# Altium schematic sheet primary_dcdc_converter.SchDoc: foxBMS BMS-Slave 12-Cell
size A3; DocumentNumber: 11; SheetNumber: 11; SheetTotal: 21; AUTHOR: Fraunhofer IISB foxBMS Team; SheetDescription: DC/DC Converter
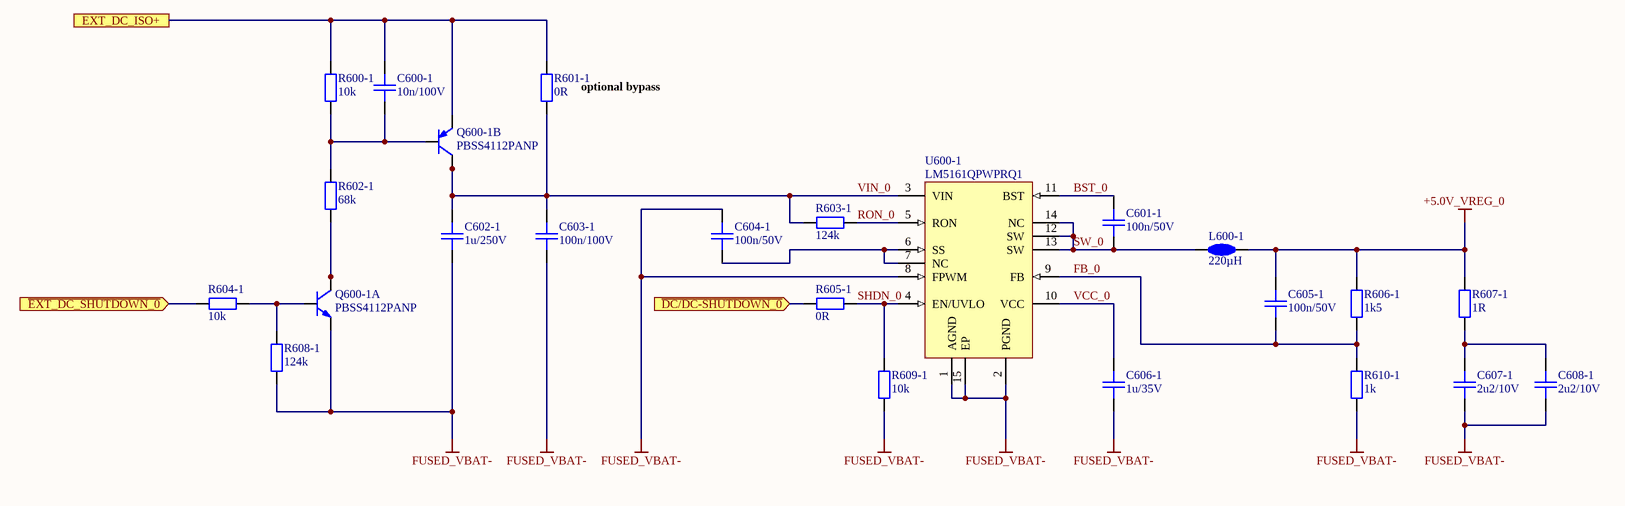
[diagram p0: primary_dcdc_converter.SchDoc]

## Parts
C600-1  10n/100V  [CAPC1608X08N]
C601-1  100n/50V  [CAPC1608X08N]
C602-1  1u/250V  [CAPC4532X16N]
C603-1  100n/100V  [CAPC2012X14N]
C604-1  100n/50V  [CAPC1608X08N]
C605-1  100n/50V  [CAPC1608X08N]
C606-1  1u/35V  [CAPC1608X08N]
C607-1  2u2/10V  [CAPC2012X14N]
C608-1  2u2/10V  [CAPC2012X14N]
L600-1  220µH  [TYS6045221M-10]
Q600-1  PBSS4112PANP  [PBSS4112PANP]  (parts A,B of 2)
R600-1  10k  [RESC1608X05N]
R601-1  0R  [RESC1608X05N]
R602-1  68k  [RESC1608X05N]
R603-1  124k  [RESC1608X05N]
R604-1  10k  [RESC1608X05N]
R605-1  0R  [RESC1608X05N]
R606-1  1k5  [RESC1608X05N]
R607-1  1R  [RESC2012X05N]
R608-1  124k  [RESC1608X05N]
R609-1  10k  [RESC1608X05N]
R610-1  1k  [RESC1608X05N]
U600-1  LM5161QPWPRQ1  [PWP0014A]

## Ports
EXT_DC_ISO+, ~{DC/DC-SHUTDOWN_0} (in), ~{EXT_DC_SHUTDOWN_0} (in)

## Nets
+5.0V_VREG_0: C605-1.2 L600-1.2 R606-1.1 R607-1.1
FUSED_VBAT-: C602-1.1 C603-1.1 C604-1.2 C606-1.2 C607-1.1 C608-1.1 Q600-1.1(E) R608-1.1 R609-1.2 R610-1.2 U600-1.1(AGND) U600-1.2(PGND) U600-1.8(FPWM) U600-1.15(EP)
~{DC/DC-SHUTDOWN_0}: R605-1.2 ; port ~{DC/DC-SHUTDOWN_0}
~{EXT_DC_SHUTDOWN_0}: R604-1.1 ; port ~{EXT_DC_SHUTDOWN_0}
BST_0: C601-1.2 U600-1.11(BST)
EXT_DC_ISO+: C600-1.1 Q600-1.4(E) R600-1.2 R601-1.2 ; port EXT_DC_ISO+
FB_0: C605-1.1 R606-1.2 R610-1.1 U600-1.9(FB)
RON_0: R603-1.1 U600-1.5(RON)
SHDN_0: R605-1.1 R609-1.1 U600-1.4(EN/UVLO)
SW_0: C601-1.1 L600-1.1 U600-1.12(SW) U600-1.13(SW) U600-1.14(NC)
VCC_0: C606-1.1 U600-1.10(VCC)
VIN_0: C602-1.2 C603-1.2 Q600-1.3(C) Q600-1.8(C) R601-1.1 R603-1.2 U600-1.3(VIN)
NetC600-1_2: C600-1.2 Q600-1.5(B) R600-1.1 R602-1.2
NetC604-1_1: C604-1.1 U600-1.6(SS) U600-1.7(NC)
NetC607-1_2: C607-1.2 C608-1.2 R607-1.2
NetQ600-1_2: Q600-1.2(B) R604-1.2 R608-1.2
NetQ600-1_6: Q600-1.6(C) Q600-1.7(C) R602-1.1

## Notes on the sheet
- (near R601-1) optional bypass
- Fraunhofer IISB
- Schottkystr. 10
- developed by:
- 91058 Erlangen
- Germany
- Author
- Project
- License
- Description
- File
- Version
- Release Date
- Sheet
- www.foxbms.org
- www.iisb.fraunhofer.de
- foxBMS Team
- /

## Library data of the parts
C600-1 = gen_C_ceramic_10n_100V_X7R_0603: MLCC; Capacitance: 10n; Rated Voltage: 100V; Dielectric: X7R; Case EIA: 0603; Case Metric: 1608; Automotive Qualified: True; PnP Package: C_0603_10; PnP Value: 10n/100V/X7R; Part Number: gen_C_ceramic_10n_100V_X7R_0603; Supplier 1: Farnell; Supplier Part Number 1: 1301715; Supplier 2: Farnell; Supplier Part Number 2: 2821192; Supplier 3: Farnell; Supplier Part Number 3: 2210878
C601-1 C604-1 C605-1 = gen_C_ceramic_100n_50V_X7R_0603: MLCC; Capacitance: 100n; Rated Voltage: 50V; Dielectric: X7R; Case EIA: 0603; Case Metric: 1608; PnP Package: C_0603_10; PnP Value: 100n/50V/X7R; PnP equipped: x; Automotive Qualified: True; Part Number: gen_C_ceramic_100n_50V_X7R_0603; Supplier 1: Farnell; Supplier Part Number 1: 2525267; Supplier 2: Digikey; Supplier Part Number 2: 490-6049-1-ND; Supplier 3: Farnell; Supplier Part Number 3: 2070398
C602-1 = gen_C_ceramic_1u_250V_X7R_1812: MLCC; Capacitance: 1u; Rated Voltage: 250V; Dielectric: X7T; Case EIA: 1812; Case Metric: 4532; Automotive Qualified: True; Part Number: gen_C_ceramic_1u_250V_X7R_1812; Supplier 1: Farnell; Supplier Part Number 1: 2435499
C603-1 = gen_C_ceramic_100n_100V_X7R_0805: MLCC; Capacitance: 100n; Rated Voltage: 100V; Dielectric: X7R; Case EIA: 0805; Case Metric: 2012; Automotive Qualified: False; Part Number: gen_C_ceramic_100n_100V_X7R_0805; Supplier 1: Farnell; Supplier Part Number 1: 2320821
C606-1 = gen_C_ceramic_1u_35V_X7R_0603: MLCC; Capacitance: 1u; Rated Voltage: 35V; Dielectric: X7R; Case EIA: 0603; Case Metric: 1608; PnP Package: C_0603_10; PnP Value: 1uF/35V/X7R; PnP equipped: x; Automotive Qualified: False; Part Number: gen_C_ceramic_1u_35V_X7R_0603; Supplier 1: Farnell; Supplier Part Number 1: 1907508
C607-1 C608-1 = gen_C_ceramic_2u2_10V_X7R_0805: MLCC; Capacitance: 2u2; Rated Voltage: 10V; Dielectric: X7R; Case EIA: 0805; Case Metric: 2012; Automotive Qualified: True; Part Number: gen_C_ceramic_2u2_10V_X7R_0805; Supplier 1: Farnell; Supplier Part Number 1: 2478259; Supplier 2: Farnell; Supplier Part Number 2: 2070513
L600-1 = TYS6045221M-10: Power Inductor; Manufacturer: Laird-Signal Integrity Products; Rated Current: 590mA; Saturation Current: 700mA; Automotive Qualified: True; Part Number: TYS6045221M-10; Operating Temperature: -55°C - +150°C; ComponentLink1Description: Datasheet; ComponentLink1URL: http://assets.lairdtech.com/home/brandworld/files/TYS6045221M-10.pdf; Inductance: 220µH; Supplier 1: Digikey; Supplier Part Number 1: 240-2742-1-ND
Q600-1 = PBSS4112PANP: Dual NPN/PNP Transistor; Part Name: DUAL PNP/NPN; Manufacturer: Nexperia; Maximum Drain-Source Voltage: 120V; Maximum Continous Drain Current (25°C): 1A; Automotive Qualified: True; Part Number: PBSS4112PANP; Operating Temperature: -55°C - +150°C; ComponentLink1Description: Datasheet; ComponentLink1URL: https://assets.nexperia.com/documents/data-sheet/PBSS4112PANP.pdf; Supplier 2: Digikey; Supplier Part Number 2: 1727-1068-1-ND; Supplier 3: Mouser; Supplier Part Number 3: 771-PBSS4112PANP
R600-1 R604-1 R609-1 = gen_R_10k_0603: SMD Resistor 10k 0603; Tolerance: 1%; Power: 0.1W; Case EIA: 0603; Case Metric: 1608; Maximum Working Voltage: 75V; PnP Package: R_0603; Automotive Qualified: True; Part Number: gen_R_10k_0603; Operating Temperature: -55°C - +155°C; Resistance: 10k; Series: E24, E96; PnP Value: 10k; Supplier 1: Farnell; Supplier Part Number 1: 2073349
R601-1 R605-1 = gen_R_0R_0603: SMD Resistor 0R 0603; Power: 0.1W; Case EIA: 0603; Case Metric: 1608; Maximum Working Voltage: 75V; PnP Package: R_0603; Automotive Qualified: True; Part Number: gen_R_0R_0603; Operating Temperature: -55°C - +155°C; Resistance: 0R; Series: Jumper; PnP Value: 0R; Supplier 1: Farnell; Supplier Part Number 1: 2616580
R602-1 = gen_R_68k_0603: SMD Resistor 68k 0603; Tolerance: 1%; Power: 0.1W; Case EIA: 0603; Case Metric: 1608; Maximum Working Voltage: 75V; PnP Package: R_0603; Automotive Qualified: False; Part Number: gen_R_68k_0603; Operating Temperature: -55°C - +155°C; Resistance: 68k; Series: E24; PnP Value: 68k
R603-1 R608-1 = gen_R_124k_0603: SMD Resistor 124k 0603; Tolerance: 1%; Power: 0.1W; Case EIA: 0603; Case Metric: 1608; Maximum Working Voltage: 75V; PnP Package: R_0603; Automotive Qualified: True; Part Number: gen_R_124k_0603; Operating Temperature: -55°C - +155°C; Resistance: 124k; Series: E96; PnP Value: 124k; Supplier 1: Farnell; Supplier Part Number 1: 2138508
R606-1 = gen_R_1k5_0603: SMD Resistor 1k5 0603; Tolerance: 1%; Power: 0.1W; Case EIA: 0603; Case Metric: 1608; Maximum Working Voltage: 75V; PnP Package: R_0603; Automotive Qualified: True; Part Number: gen_R_1k5_0603; Operating Temperature: -55°C - +155°C; Resistance: 1k5; Series: E24, E96; PnP Value: 1k5; Supplier 1: Farnell; Supplier Part Number 1: 2616745
R607-1 = gen_R_1R_0805: SMD Resistor 1R 0805; Tolerance: 1%; Power: 0.125W; Case EIA: 0805; Case Metric: 2012; Maximum Working Voltage: 150V; PnP Package: R_0805; Automotive Qualified: True; Part Number: gen_R_1R_0805; Operating Temperature: -55°C - +155°C; Resistance: 1R; Series: E24, E96; PnP Value: 1R; Supplier 1: Farnell; Supplier Part Number 1: 2616757
R610-1 = gen_R_1k_0603: SMD Resistor 1k 0603; Tolerance: 1%; Power: 0.1W; Case EIA: 0603; Case Metric: 1608; Maximum Working Voltage: 75V; PnP Package: R_0603; Automotive Qualified: True; PnP equipped: x; Part Number: gen_R_1k_0603; Operating Temperature: -55°C - +155°C; Resistance: 1k; Series: E24, E96; PnP Value: 1k; Supplier 1: Farnell; Supplier Part Number 1: 1652848
U600-1 = LM5161QPWPRQ1: Automotive DC/DC buck converter; Manufacturer: Texas Instruments; PnP Package: HTSSOP-14; Automotive Qualified: True; Part Number: LM5161QPWPRQ1; Part Name: LM5161QPWPRQ1; Operating Temperature: −40°C - +125°C; Supplier 1: Digikey; Supplier Part Number 1: 296-47791-1-ND; Supplier 2: Mouser; Supplier Part Number 2: 595-LM5161QPWPRQ1